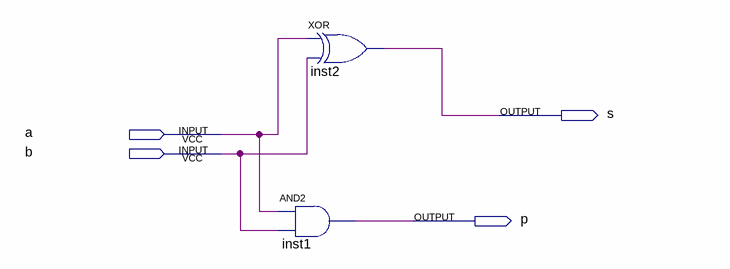
[diagram p0: schematic sheet]
// Quartus schematic halfsum.bdf as structural Verilog: 2 symbols, 4 pins
module halfsum (
  input  a,
  input  b,
  output s,
  output p
);

  and inst1 (p, a, b);
  xor inst2 (s, a, b);
endmodule
